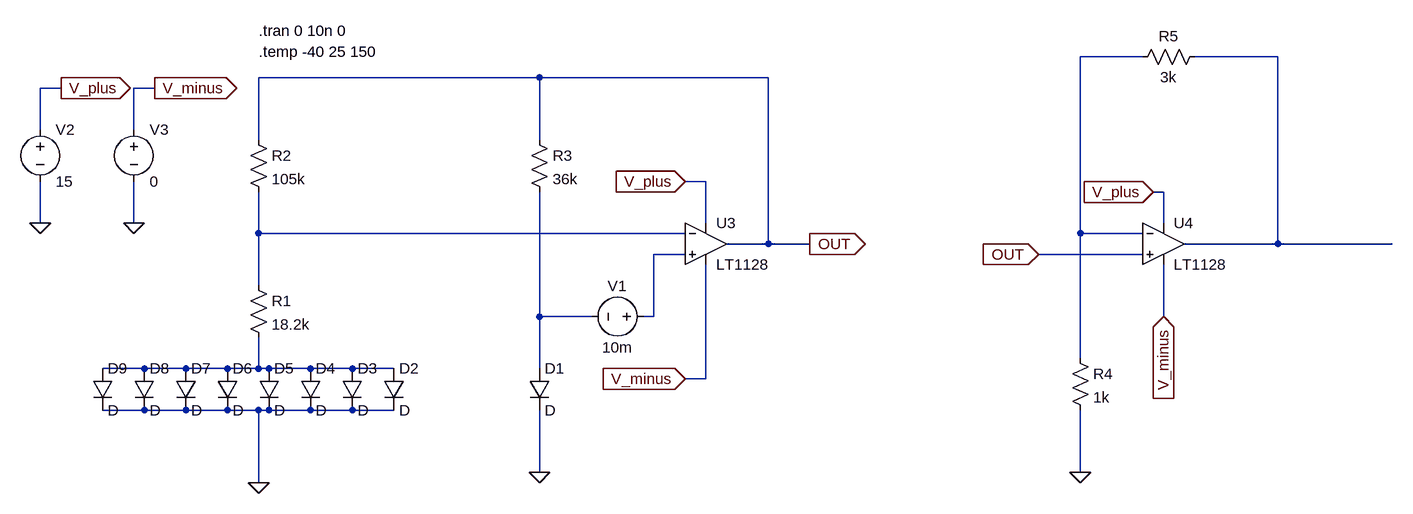
[diagram p0: schematic Report1.asc]
Report1.asc, the LTspice schematic file:
Version 4
SHEET 1 1332 680
WIRE 848 -208 752 -208
WIRE 1056 -208 928 -208
WIRE -80 -176 -512 -176
WIRE 272 -176 -80 -176
WIRE -816 -160 -848 -160
WIRE -672 -160 -704 -160
WIRE -848 -96 -848 -160
WIRE -704 -96 -704 -160
WIRE -512 -80 -512 -176
WIRE -80 -80 -80 -176
WIRE 176 -16 144 -16
WIRE 880 0 864 0
WIRE -848 48 -848 -16
WIRE -704 48 -704 -16
WIRE 176 48 176 -16
WIRE 880 48 880 0
WIRE -512 64 -512 0
WIRE 144 64 -512 64
WIRE 752 64 752 -208
WIRE 848 64 752 64
WIRE 272 80 272 -176
WIRE 272 80 208 80
WIRE 336 80 272 80
WIRE 1056 80 1056 -208
WIRE 1056 80 912 80
WIRE 1232 80 1056 80
WIRE 144 96 96 96
WIRE 848 96 688 96
WIRE -512 144 -512 64
WIRE -80 192 -80 0
WIRE 0 192 -80 192
WIRE 96 192 96 96
WIRE 96 192 80 192
WIRE 880 192 880 112
WIRE 752 256 752 64
WIRE -688 272 -752 272
WIRE -624 272 -688 272
WIRE -560 272 -624 272
WIRE -512 272 -512 224
WIRE -512 272 -560 272
WIRE -496 272 -512 272
WIRE -432 272 -496 272
WIRE -368 272 -432 272
WIRE -304 272 -368 272
WIRE -80 272 -80 192
WIRE 176 288 176 112
WIRE 176 288 144 288
WIRE -688 336 -752 336
WIRE -624 336 -688 336
WIRE -560 336 -624 336
WIRE -512 336 -560 336
WIRE -496 336 -512 336
WIRE -432 336 -496 336
WIRE -368 336 -432 336
WIRE -304 336 -368 336
WIRE -80 432 -80 336
WIRE 752 432 752 336
WIRE -512 448 -512 336
FLAG -704 48 0
FLAG -848 48 0
FLAG -816 -160 V_plus
IOPIN -816 -160 Out
FLAG -672 -160 V_minus
IOPIN -672 -160 Out
FLAG 336 80 OUT
IOPIN 336 80 Out
FLAG 144 -16 V_plus
IOPIN 144 -16 In
FLAG 144 288 V_minus
IOPIN 144 288 In
FLAG -80 432 0
FLAG -512 448 0
FLAG 688 96 OUT
IOPIN 688 96 In
FLAG 752 432 0
FLAG 864 0 V_plus
IOPIN 864 0 In
FLAG 880 192 V_minus
IOPIN 880 192 In
SYMBOL diode -96 272 R0
SYMATTR InstName D1
SYMBOL diode -320 272 R0
SYMATTR InstName D2
SYMBOL diode -384 272 R0
SYMATTR InstName D3
SYMBOL diode -448 272 R0
SYMATTR InstName D4
SYMBOL diode -512 272 R0
SYMATTR InstName D5
SYMBOL diode -576 272 R0
SYMATTR InstName D6
SYMBOL diode -640 272 R0
SYMATTR InstName D7
SYMBOL diode -704 272 R0
SYMATTR InstName D8
SYMBOL diode -768 272 R0
SYMATTR InstName D9
SYMBOL res -528 128 R0
SYMATTR InstName R1
SYMATTR Value 18.2k
SYMBOL res -528 -96 R0
SYMATTR InstName R2
SYMATTR Value 105k
SYMBOL res -96 -96 R0
SYMATTR InstName R3
SYMATTR Value 36k
SYMBOL voltage 96 192 R90
WINDOW 0 -32 56 VBottom 2
WINDOW 3 32 56 VTop 2
WINDOW 123 0 0 Left 0
WINDOW 39 0 0 Left 0
SYMATTR InstName V1
SYMATTR Value 10m
SYMBOL voltage -848 -112 R0
WINDOW 123 0 0 Left 0
WINDOW 39 0 0 Left 0
SYMATTR InstName V2
SYMATTR Value 15
SYMBOL voltage -704 -112 R0
WINDOW 123 0 0 Left 0
WINDOW 39 0 0 Left 0
SYMATTR InstName V3
SYMATTR Value 0
SYMBOL res 736 240 R0
SYMATTR InstName R4
SYMATTR Value 1k
SYMBOL res 944 -224 R90
WINDOW 0 0 56 VBottom 2
WINDOW 3 32 56 VTop 2
SYMATTR InstName R5
SYMATTR Value 3k
SYMBOL Opamps\\LT1128 176 16 R0
SYMATTR InstName U3
SYMBOL Opamps\\LT1128 880 16 R0
SYMATTR InstName U4
TEXT -512 -248 Left 2 !.tran 0 10n 0
TEXT -512 -216 Left 2 !.temp -40 25 150

The netlist it stands for:
* Report1.asc
D1 N005 0 D
D2 N006 0 D
D3 N006 0 D
D4 N006 0 D
D5 N006 0 D
D6 N006 0 D
D7 N006 0 D
D8 N006 0 D
D9 N006 0 D
R1 N003 N006 18.2k
R2 OUT N003 105k
R3 OUT N005 36k
V1 N004 N005 10m
V2 V_plus 0 15
V3 V_minus 0 0
R4 N001 0 1k
R5 N002 N001 3k
XU3 N004 N003 V_plus V_minus OUT LT1128  ; pins In+ In- V+ V- OUT
XU4 OUT N001 V_plus V_minus N002 LT1128  ; pins In+ In- V+ V- OUT
.model D D
.lib standard.dio
.tran 0 10n 0
.temp -40 25 150
.lib LTC.lib
.backanno
.end